# EAGLE schematic I2C Module v8 wo PS (EAGLE 6.1)
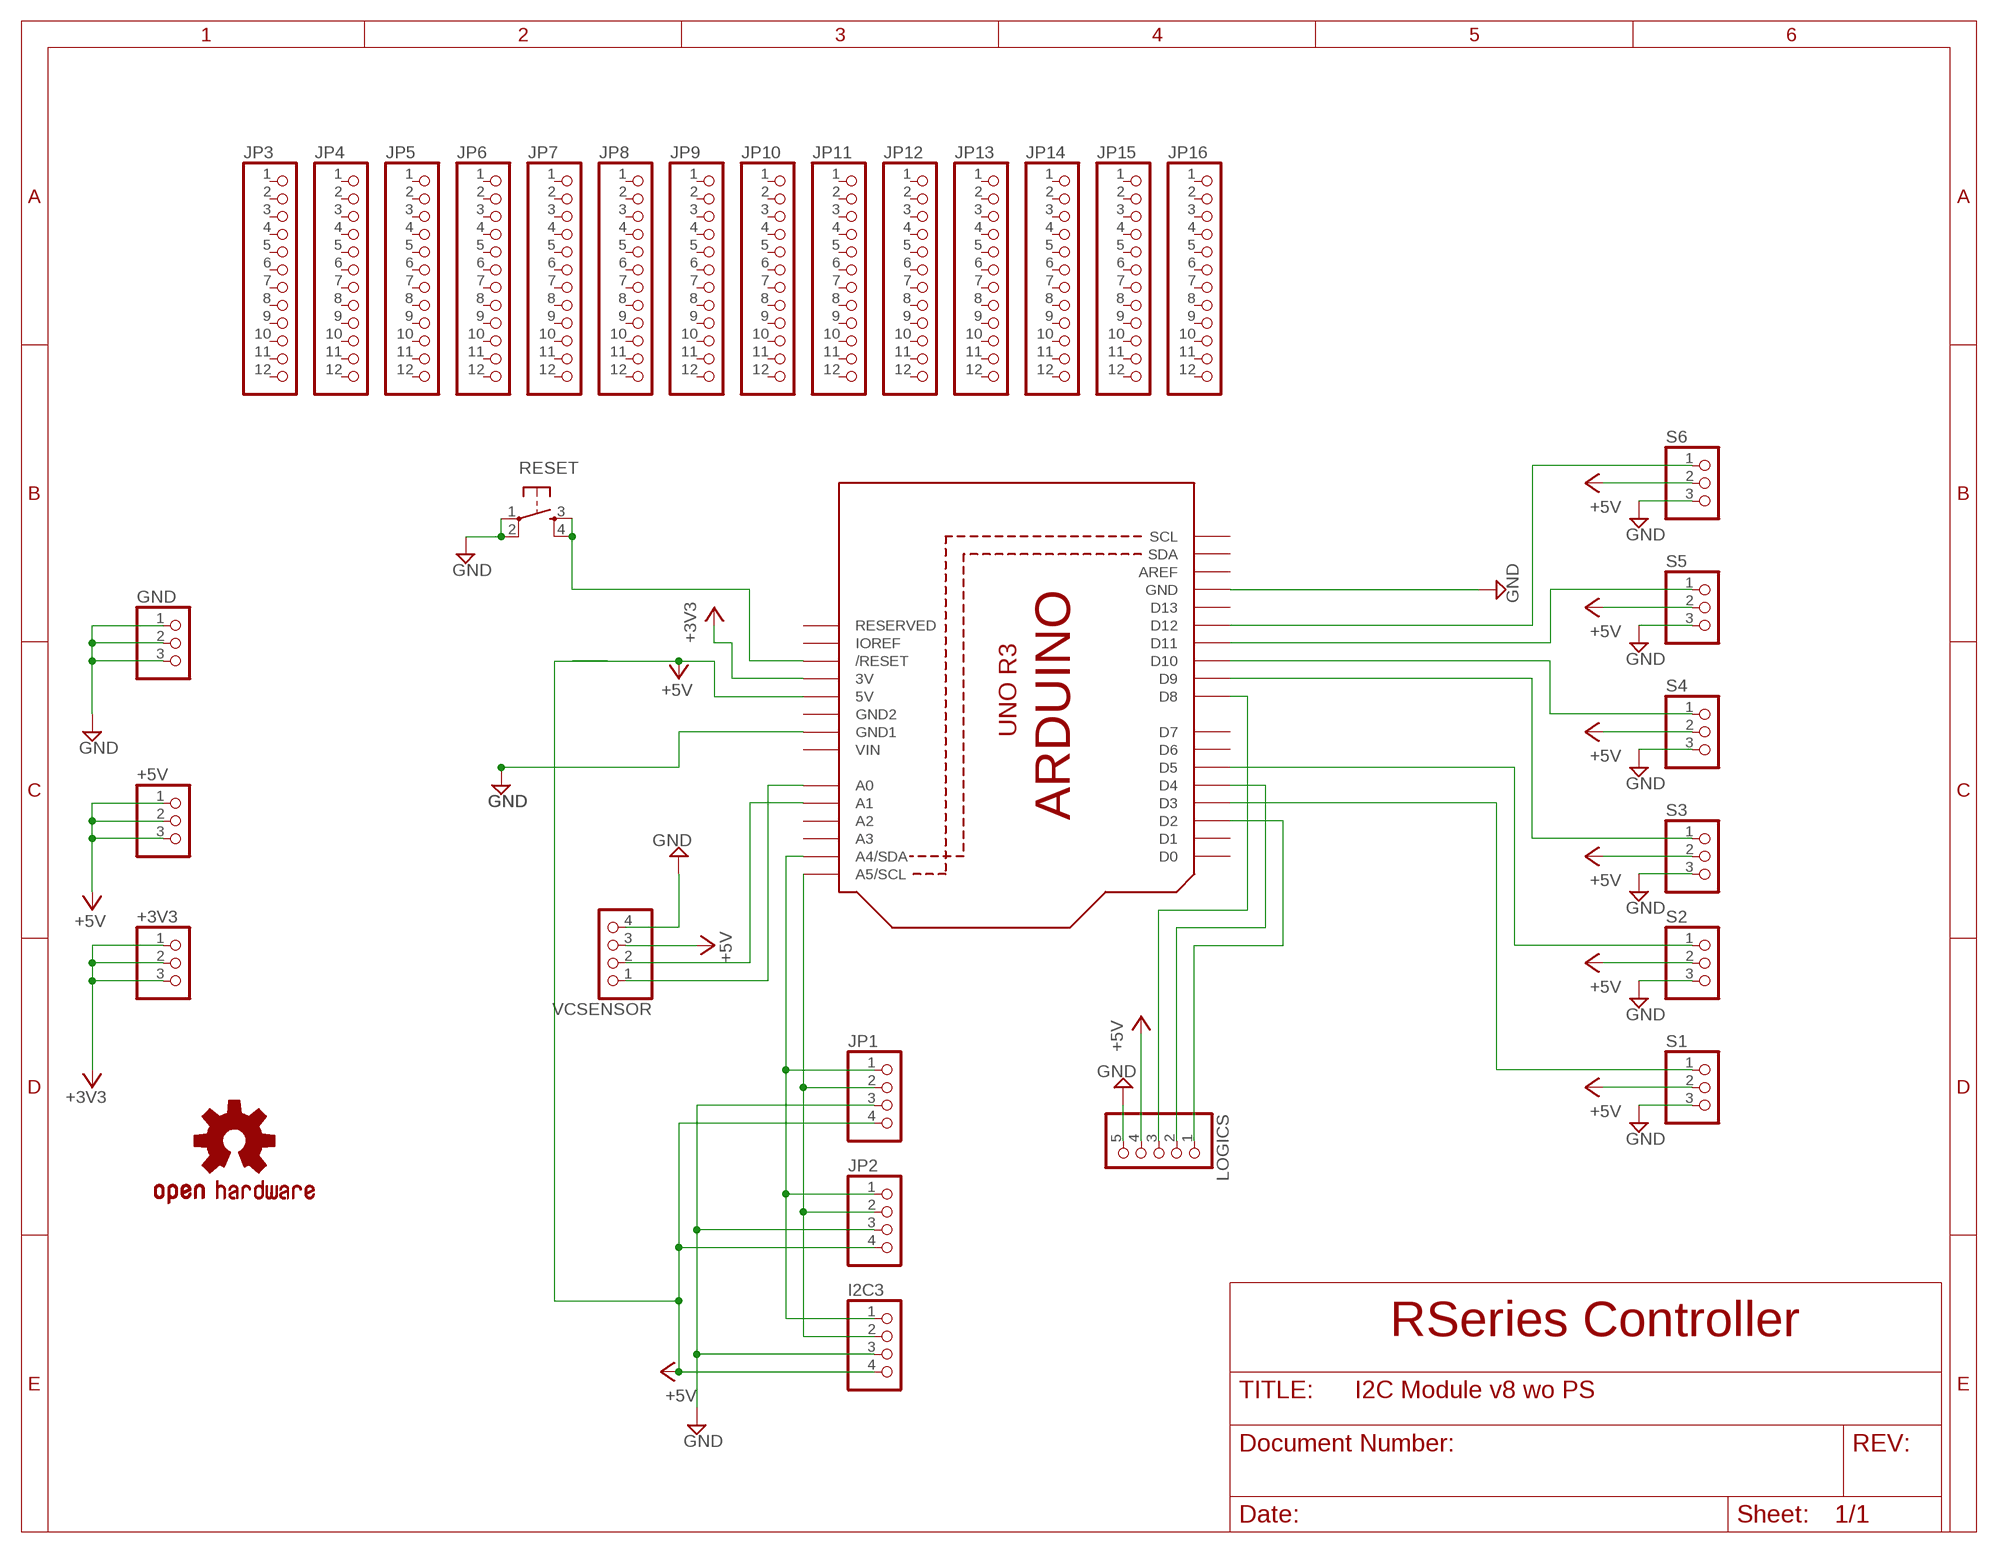
[diagram p0: schematic, sheet 1]

## Parts
+3V3  PINHD-1X3CB  [1X03-CLEANBIG]
+5V  PINHD-1X3CB  [1X03-CLEANBIG]
GND  PINHD-1X3CB  [1X03-CLEANBIG]
I2C3  PINHD-1X4  [1X04]
JP1  PINHD-1X4  [1X04]
JP2  PINHD-1X4  [1X04]
JP3  PINHD-1X12-CB  [1X12-CB]
JP4  PINHD-1X12-CB  [1X12-CB]
JP5  PINHD-1X12-CB  [1X12-CB]
JP6  PINHD-1X12-CB  [1X12-CB]
JP7  PINHD-1X12-CB  [1X12-CB]
JP8  PINHD-1X12-CB  [1X12-CB]
JP9  PINHD-1X12-CB  [1X12-CB]
JP10  PINHD-1X12-CB  [1X12-CB]
JP11  PINHD-1X12-CB  [1X12-CB]
JP12  PINHD-1X12-CB  [1X12-CB]
JP13  PINHD-1X12-CB  [1X12-CB]
JP14  PINHD-1X12-CB  [1X12-CB]
JP15  PINHD-1X12-CB  [1X12-CB]
JP16  PINHD-1X12-CB  [1X12-CB]
LOGICS  PINHD-1X5  [1X05]
RESET  TAC_SWITCHPTH  [TACTILE-PTH]
S1  PINHD-1X3  [1X03]
S2  PINHD-1X3  [1X03]
S3  PINHD-1X3  [1X03]
S4  PINHD-1X3  [1X03]
S5  PINHD-1X3  [1X03]
S6  PINHD-1X3  [1X03]
U1  ARDUINOR3-DIMENSION  [ARDUINOR3]
U$1  OSHW-LOGOM  [OSHW-LOGO-M]
VCSENSOR  PINHD-1X4  [1X04]

## Nets
+3V3 [POWER]: +3V3.1 +3V3.2 +3V3.3 U1.3V
+5V [POWER]: +5V.1 +5V.2 +5V.3 I2C3.4 JP1.4 JP2.4 LOGICS.4 S1.2 S2.2 S3.2 S4.2 S5.2 S6.2 U1.5V VCSENSOR.3
GND [POWER]: GND.1 GND.2 GND.3 I2C3.3 JP1.3 JP2.3 LOGICS.5 RESET.1 RESET.2 S1.3 S2.3 S3.3 S4.3 S5.3 S6.3 U1.GND U1.GND1 VCSENSOR.4
N$1: U1.A0 VCSENSOR.1
N$2: LOGICS.3 U1.D8
N$3: U1.A1 VCSENSOR.2
N$4: S1.1 U1.D3
N$5: S2.1 U1.D5
N$6: S3.1 U1.D9
N$7: S4.1 U1.D10
N$8: S5.1 U1.D11
N$9: S6.1 U1.D12
N$10: LOGICS.2 U1.D4
N$11: LOGICS.1 U1.D2
N$12: RESET.3 RESET.4 U1.RESET(/RESET)
N$15: I2C3.2 JP1.2 JP2.2 U1.A5(A5/SCL)
N$16: I2C3.1 JP1.1 JP2.1 U1.A4(A4/SDA)
Unconnected: JP3.1 JP3.2 JP3.3 JP3.4 JP3.5 JP3.6 JP3.7 JP3.8 JP3.9 JP3.10 JP3.11 JP3.12 JP4.1 JP4.2 JP4.3 JP4.4 JP4.5 JP4.6 JP4.7 JP4.8 JP4.9 JP4.10 JP4.11 JP4.12 JP5.1 JP5.2 JP5.3 JP5.4 JP5.5 JP5.6 JP5.7 JP5.8 JP5.9 JP5.10 JP5.11 JP5.12 JP6.1 JP6.2 JP6.3 JP6.4 JP6.5 JP6.6 JP6.7 JP6.8 JP6.9 JP6.10 JP6.11 JP6.12 JP7.1 JP7.2 JP7.3 JP7.4 JP7.5 JP7.6 JP7.7 JP7.8 JP7.9 JP7.10 JP7.11 JP7.12 JP8.1 JP8.2 JP8.3 JP8.4 JP8.5 JP8.6 JP8.7 JP8.8 JP8.9 JP8.10 JP8.11 JP8.12 JP9.1 JP9.2 JP9.3 JP9.4 JP9.5 JP9.6 JP9.7 JP9.8 JP9.9 JP9.10 JP9.11 JP9.12 JP10.1 JP10.2 JP10.3 JP10.4 JP10.5 JP10.6 JP10.7 JP10.8 JP10.9 JP10.10 JP10.11 JP10.12 JP11.1 JP11.2 JP11.3 JP11.4 JP11.5 JP11.6 JP11.7 JP11.8 JP11.9 JP11.10 JP11.11 JP11.12 JP12.1 JP12.2 JP12.3 JP12.4 JP12.5 JP12.6 JP12.7 JP12.8 JP12.9 JP12.10 JP12.11 JP12.12 JP13.1 JP13.2 JP13.3 JP13.4 JP13.5 JP13.6 JP13.7 JP13.8 JP13.9 JP13.10 JP13.11 JP13.12 JP14.1 JP14.2 JP14.3 JP14.4 JP14.5 JP14.6 JP14.7 JP14.8 JP14.9 JP14.10 JP14.11 JP14.12 JP15.1 JP15.2 JP15.3 JP15.4 JP15.5 JP15.6 JP15.7 JP15.8 JP15.9 JP15.10 JP15.11 JP15.12 JP16.1 JP16.2 JP16.3 JP16.4 JP16.5 JP16.6 JP16.7 JP16.8 JP16.9 JP16.10 JP16.11 JP16.12 U1.A2 U1.A3 U1.AREF U1.D0 U1.D1 U1.D6 U1.D7 U1.D13 U1.IOREF U1.RESERVED U1.SCL U1.SDA

## Notes on the sheet
- RSeries Controller

## Power pins joined to a net without a drawn wire
GND2: U1.GND2
VIN: U1.VIN

## Library data of the parts
+3V3 +5V GND S1-S6 = adafruit:PINHD-1X3: PIN HEADER
I2C3 JP1 JP2 VCSENSOR = pinhead:PINHD-1X4: PIN HEADER
JP3-JP16 = adafruit:PINHD-1X12: PIN HEADER
LOGICS = pinhead:PINHD-1X5: PIN HEADER
RESET = SparkFun-Electromechanical:TAC_SWITCH: Momentary Switch Button commonly used for reset or general input. Spark Fun Electronics SKU : COM-00097
U1 = adafruit:ARDUINOR3: This is a new object for the new Arduino R3 - with extra pins that you may want to use (such as IOref, and duplicated A4/A5
U$1 = SparkFun-Aesthetics:OSHW-LOGO: Open Source Hardware Logo This logo indicates the piece of hardware it is found on incorporates a OSHW license and/or adheres to the definition of open source hardware found here: http://freedomdefined.org/OSHW

## Net classes
1 POWER: width 0.635 mm, clearance 0.254 mm